# Altium schematic sheet v2.0_with_IO_Expander.SchDoc
size A3
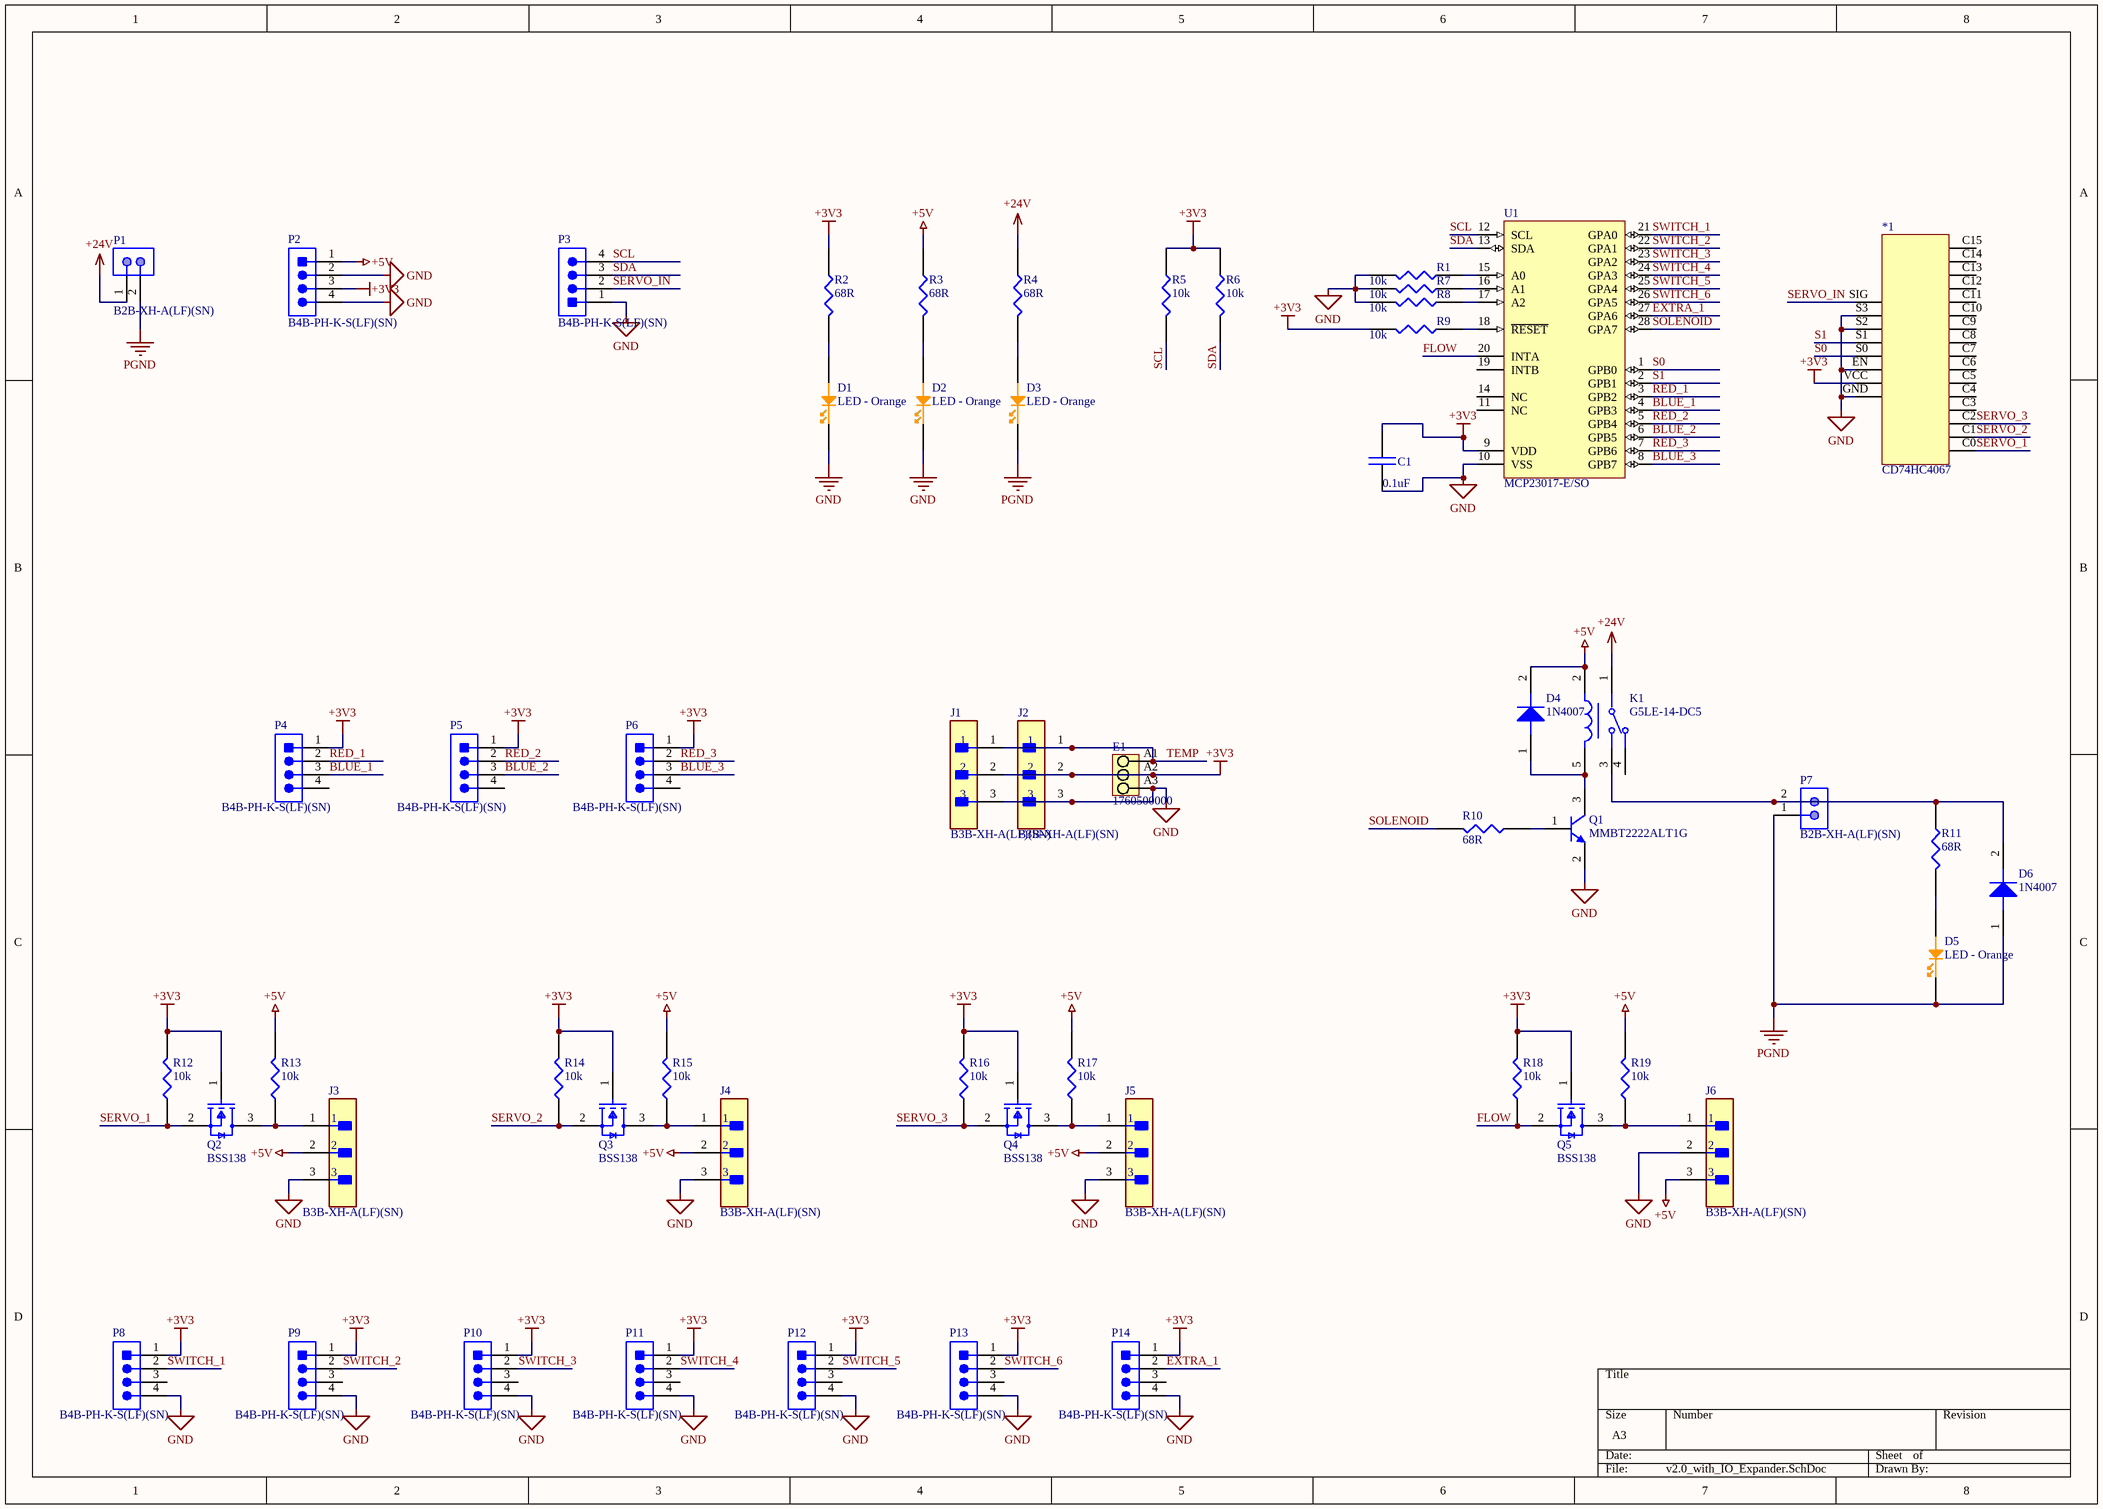
[diagram p0: v2.0_with_IO_Expander.SchDoc]

## Parts
*1  CD74HC4067  [CD74HC4067 Module]
C1  0.1uF  [0.1uF 0603]
D1  LED - Orange  [LED0603-Orange]
D2  LED - Orange  [LED0603-Orange]
D3  LED - Orange  [LED0603-Orange]
D4  1N4007  [M7 1N4007 SMA]
D5  LED - Orange  [LED0603-Orange]
D6  1N4007  [M7 1N4007 SMA]
E1  1760500000  [PM_5_08_90_03]
J1  B3B-XH-A(LF)(SN)  [FP-B3B-XH-A_LF_SN-MFG]
J2  B3B-XH-A(LF)(SN)  [FP-B3B-XH-A_LF_SN-MFG]
J3  B3B-XH-A(LF)(SN)  [FP-B3B-XH-A_LF_SN-MFG]
J4  B3B-XH-A(LF)(SN)  [FP-B3B-XH-A_LF_SN-MFG]
J5  B3B-XH-A(LF)(SN)  [FP-B3B-XH-A_LF_SN-MFG]
J6  B3B-XH-A(LF)(SN)  [FP-B3B-XH-A_LF_SN-MFG]
K1  G5LE-14-DC5  [FP-G5LE-14-DC5-MFG]
P1  B2B-XH-A(LF)(SN)  [JST-B2B-XH-A_V]
P2  B4B-PH-K-S(LF)(SN)  [JST-B4B-PH-K-S_V]
P3  B4B-PH-K-S(LF)(SN)  [JST-B4B-PH-K-S_V]
P4  B4B-PH-K-S(LF)(SN)  [JST-B4B-PH-K-S_V]
P5  B4B-PH-K-S(LF)(SN)  [JST-B4B-PH-K-S_V]
P6  B4B-PH-K-S(LF)(SN)  [JST-B4B-PH-K-S_V]
P7  B2B-XH-A(LF)(SN)  [JST-B2B-XH-A_V]
P8  B4B-PH-K-S(LF)(SN)  [JST-B4B-PH-K-S_V]
P9  B4B-PH-K-S(LF)(SN)  [JST-B4B-PH-K-S_V]
P10  B4B-PH-K-S(LF)(SN)  [JST-B4B-PH-K-S_V]
P11  B4B-PH-K-S(LF)(SN)  [JST-B4B-PH-K-S_V]
P12  B4B-PH-K-S(LF)(SN)  [JST-B4B-PH-K-S_V]
P13  B4B-PH-K-S(LF)(SN)  [JST-B4B-PH-K-S_V]
P14  B4B-PH-K-S(LF)(SN)  [JST-B4B-PH-K-S_V]
Q1  MMBT2222ALT1G  [ONSC-SOT-23-3-318-08_V]
Q2  BSS138  [FP-318-08-IPC_B]
Q3  BSS138  [FP-318-08-IPC_B]
Q4  BSS138  [FP-318-08-IPC_B]
Q5  BSS138  [FP-318-08-IPC_B]
R1  10k  [10k R0603]
R2  68R  [68R 0603]
R3  68R  [68R 0603]
R4  68R  [68R 0603]
R5  10k  [10k R0603]
R6  10k  [10k R0603]
R7  10k  [10k R0603]
R8  10k  [10k R0603]
R9  10k  [10k R0603]
R10  68R  [68R 0603]
R11  68R  [68R 0603]
R12  10k  [10k R0603]
R13  10k  [10k R0603]
R14  10k  [10k R0603]
R15  10k  [10k R0603]
R16  10k  [10k R0603]
R17  10k  [10k R0603]
R18  10k  [10k R0603]
R19  10k  [10k R0603]
U1  MCP23017-E/SO  [SOIC-SO28_N]

## Nets
+3V3: *1.VCC(C17) C1.1 E1.A2 J1.2 J2.2 P2.3 P4.1 P5.1 P6.1 P8.1 P9.1 P10.1 P11.1 P12.1 P13.1 P14.1 Q2.1(G) Q3.1(G) Q4.1(G) Q5.1(G) R2.1 R5.1 R6.1 R9.2 R12.2 R14.2 R16.2 R18.2 U1.9(VDD)
+5V: D4.2(Cathode) J3.2 J4.2 J5.2 J6.3 K1.2 P2.1 R3.1 R13.2 R15.2 R17.2 R19.2
+24V: K1.1 P1.1 R4.1
GND: *1.EN(C18) *1.GND(C16) *1.S2(C21) *1.S3(C22) C1.2 D1.1(Cathode) D2.1(Cathode) E1.A3 J1.3 J2.3 J3.3 J4.3 J5.3 J6.2 P2.2 P2.4 P3.1 P8.4 P9.4 P10.4 P11.4 P12.4 P13.4 P14.4 Q1.2(E) R1.2 R7.2 R8.2 U1.10(VSS)
PGND: D3.1(Cathode) D5.1(Cathode) D6.1(Anode) P1.2 P7.1
BLUE_1: P4.3 U1.4(GPB3)
BLUE_2: P5.3 U1.6(GPB5)
BLUE_3: P6.3 U1.8(GPB7)
EXTRA_1: P14.2 U1.27(GPA6)
FLOW: Q5.2(S) R18.1 U1.20(INTA)
RED_1: P4.2 U1.3(GPB2)
RED_2: P5.2 U1.5(GPB4)
RED_3: P6.2 U1.7(GPB6)
S0: *1.S0(C19) U1.1(GPB0)
S1: *1.S1(C20) U1.2(GPB1)
SCL: P3.4 R5.2 U1.12(SCL)
SDA: P3.3 R6.2 U1.13(SDA)
SERVO_1: *1.C0 Q2.2(S) R12.1
SERVO_2: *1.C1 Q3.2(S) R14.1
SERVO_3: *1.C2 Q4.2(S) R16.1
SERVO_IN: *1.SIG(C23) P3.2
SOLENOID: R10.2 U1.28(GPA7)
SWITCH_1: P8.2 U1.21(GPA0)
SWITCH_2: P9.2 U1.22(GPA1)
SWITCH_3: P10.2 U1.23(GPA2)
SWITCH_4: P11.2 U1.24(GPA3)
SWITCH_5: P12.2 U1.25(GPA4)
SWITCH_6: P13.2 U1.26(GPA5)
TEMP: E1.A1 J1.1 J2.1
NetD1_2: D1.2(Anode) R2.2
NetD2_2: D2.2(Anode) R3.2
NetD3_2: D3.2(Anode) R4.2
NetD4_1: D4.1(Anode) K1.5 Q1.3(C)
NetD5_2: D5.2(Anode) R11.2
NetD6_2: D6.2(Cathode) K1.3 P7.2 R11.1
NetJ3_1: J3.1 Q2.3(D) R13.1
NetJ4_1: J4.1 Q3.3(D) R15.1
NetJ5_1: J5.1 Q4.3(D) R17.1
NetJ6_1: J6.1 Q5.3(D) R19.1
NetQ1_1: Q1.1(B) R10.1
NetR1_1: R1.1 U1.15(A0)
NetR7_1: R7.1 U1.16(A1)
NetR8_1: R8.1 U1.17(A2)
NetR9_1: R9.1 U1.18(~{RESET})

Not connected (* = marked no-connect by the designer): *1 C3(4) C4(5) C5(6) C6(7) C7(8) C8(9) C9(10) C10(11) C11(12) C12(13) C13(14) C14(15) C15(16); K1 4; P4 4; P5 4; P6 4; P8 3; P9 3; P10 3; P11 3; P12 3; P13 3; P14 3; U1 11(NC) 14(NC) 19(INTB)

## Library data of the parts
C1 = C0603C104M4RACTU: CAP CER 0.1UF 16V X7R 0603; Manufacturer: KEMET; Dielectric Material: Ceramic; Capacitance: 100nF; Tolerance: 20%; Supplier 1: Digi-Key; Supplier Part Number 1: 399-1099-1-ND; Manufacturer Part Number: C0603C104M4RACTU; RoHS: Yes; Category: Ceramic Capacitors; Stock 1: 114153; Pricing 1: 1=0.10000, 10=0.03100, 50=0.01720, 100=0.01400, 500=0.01002, 1000=0.00787 (USD); Mount: Surface Mount,PCB; Case/Package: 0603; Number of Pins: 2; Case Code (Metric): 1608; Case Code (Imperial): 0603; Min Operating Temperature: -55°C; Max Operating Temperature: 125°C; Package Quantity: 1; Voltage Rating: 16V; Packaging: Tape and Reel; Voltage Rating (DC): 16V; Dielectric: X7R; Termination: SMD/SMT; Length: 1.6mm; Height: 0.8mm; Width: 0.031inch; Thickness: 0.034inch; Lead Pitch: 0.7mm; Depth: 0.8mm; Radiation Hardening: No; REACH SVHC: No SVHC; ComponentLink1URL: https://datasheet.ciiva.com/18102/getdatasheetpartid-66190-18102310.pdf?src-supplier=Verical; ComponentLink1Description: https://datasheet.ciiva.com/18102/getdatasheetpartid-66190-18102310.pdf?src-supplier=Verical; ComponentLink2URL: https://datasheet.ciiva.com/7823/kem-c1002-x7r-smd-7823992.pdf?src-supplier=Element14; ComponentLink2Description: https://datasheet.ciiva.com/7823/kem-c1002-x7r-smd-7823992.pdf?src-supplier=Element14; ComponentLink3URL: https://datasheet.ciiva.com/7823/kem-c1002-x7r-smd-7823993.pdf?src-supplier=Element14; ComponentLink3Description: https://datasheet.ciiva.com/7823/kem-c1002-x7r-smd-7823993.pdf?src-supplier=Element14; ComponentLink4URL: https://datasheet.ciiva.com/14589/70095383-14589450.pdf?src-supplier=Allied+Electronics; ComponentLink4Description: https://datasheet.ciiva.com/14589/70095383-14589450.pdf?src-supplier=Allied+Electronics; ComponentLink5URL: https://datasheet.ciiva.com/18192/getdatasheetpartid-302288-18192716.pdf?src-supplier=Verical; ComponentLink5Description: https://datasheet.ciiva.com/18192/getdatasheetpartid-302288-18192716.pdf?src-supplier=Verical
D1-D3 D5 = LTST-C191KFKT: LED ORANGE CLEAR SMD; Manufacturer: Vishay Lite-On; Lens Color: Colorless; Wavelength: 611nm; Number of LEDs: 1; Viewing Angle: 130°; Lens Style: Diffused,Colorless,Rectangular; Luminous Intensity: 90mcd; Forward Current: 30mA; Forward Voltage: 2V; Power Rating: 75mW; Reverse Voltage: 5V; Dominant Wavelength: 605nm; Test Current: 20mA; Supplier 1: Digi-Key; Supplier Part Number 1: 160-1445-1-ND; Manufacturer Part Number: LTST-C191KFKT; RoHS: Yes; Category: LEDs; Stock 1: 92562; Pricing 1: 1=0.24000, 10=0.17900, 100=0.08460, 500=0.05640, 1000=0.04418, 2500=0.04324 (USD); Mount: Surface Mount; Case/Package: 0603; Number of Pins: 2; Case Code (Metric): 1608; Color: Orange; Case Code (Imperial): 0603; Min Operating Temperature: -55°C; Max Operating Temperature: 85°C; Package Quantity: 1; Packaging: Tape and Reel; Illumination Color: Orange; Lens Transparency: Clear; Number of Elements: 1; Power Dissipation: 75mW; Length: 1.6mm; Height: 0.55mm; Width: 0.8mm; Depth: 0.8mm; Radiation Hardening: No; Lead Free: Lead Free; ComponentLink1URL: https://datasheet.ciiva.com/2109/ltst-c191kfkt-2109968.pdf?src-supplier=Digi-Key; ComponentLink1Description: https://datasheet.ciiva.com/2109/ltst-c191kfkt-2109968.pdf?src-supplier=Digi-Key; ComponentLink2URL: https://datasheet.ciiva.com/12400/100-ltst-c191kfkt-39904-12400811.pdf?src-supplier=Mouser; ComponentLink2Description: https://datasheet.ciiva.com/12400/100-ltst-c191kfkt-39904-12400811.pdf?src-supplier=Mouser; ComponentLink3URL: https://datasheet.ciiva.com/11775/0900766b80dc02b0-11775613.pdf?src-supplier=RSComponents; ComponentLink3Description: https://datasheet.ciiva.com/11775/0900766b80dc02b0-11775613.pdf?src-supplier=RSComponents; ComponentLink4URL: https://datasheet.ciiva.com/15201/getdatasheetpartid-631075-15201391.pdf?src-supplier=Verical; ComponentLink4Description: https://datasheet.ciiva.com/15201/getdatasheetpartid-631075-15201391.pdf?src-supplier=Verical; ComponentLink5URL: https://datasheet.ciiva.com/2109/s-110-ltst-c191kfkt-2109969.pdf?src-supplier=Digi-Key; ComponentLink5Description: https://datasheet.ciiva.com/2109/s-110-ltst-c191kfkt-2109969.pdf?src-supplier=Digi-Key
D4 D6 = 1N4007FLTR: 1000V 1A Rectifier; Manufacturer: Sangdest Microelectronics; Supplier 1: Digi-Key; Supplier Part Number 1: 1655-1N4007FLCT-ND; Manufacturer Part Number: 1N4007FLTR; RoHS: No; Stock 1: 2517; Pricing 1: 1=0.10000, 10=0.06600, 100=0.03120, 500=0.01848, 1000=0.01241 (USD)
E1 = CMP-1559-01629-1: OMNIMATE Signal - series PM; Manufacturer: Weidmueller; Pitch_mm: 5,08 mm; Pitch_inch: 0,2 inch; Wire_cross_section_AWG_min_UL_1059: AWG 26; Contact_surface: tinned; Contact_material: Cu-Leg; Short_text_for_material: PM 5.08/03/90 3.5SN OR BX; Rated_voltage_use_group_B_UL_1059: 300 V; Solid_min_H05_07_V_U: 0,13 mm²; Solder_pin_length_mm: 3,5 mm; Rated_voltage_for_surge_voltage_class_pollution_degree_II_2: 600 V; Mounting_onto_the_PCB: Solder connection; Solid_max_H05_07_V_U: 2,5 mm²; Side_termination_characteristic: closed side; Rated_current_use_group_B_UL_1059: 15 A; Wire_cross_section_AWG_max_UL_1059: AWG 14; Insulating_material: Wemid (PA); UL_94_flammability_rating: V-0; No_of_poles: 3; ComponentLink2Description: URL Link1; ComponentLink1Description: Manufacturer URL; PartNumber: 1760500000; ComponentLink2URL: http://catalog.weidmueller.com/catalog/Start.do?localeId=en&ObjectID=1760500000; ComponentLink1URL: http://www.weidmueller.com/; Qty: 500 PCS; Colour: Orange; Packaging: Box; Revision: V1; PackageReference: PM_5_08_90_03
J1-J6 = CMP-17439-000014-1: CONN HEADER VERT 3POS 2.5MM; Manufacturer: JST; Conn Gender: Male; Conn Orientation: Vertical; Voltage Rating: 250V; Number Of Contacts: 3; Current Rating: 3A; Contact Material: Tin,Copper; Temperature Range Low: -25°C; Octopart: https://octopart.com/b3b-xh-a%28lf%29%28sn%29-jst-3990185; Device Class L3: unset; Device Class L1: Connectors; Lead Free: Yes; Temperature: -25°C to +85°C; Manufacturer Part Number: B3B-XH-A(LF)(SN); Package: 0; ComponentLink2Description: Datasheet; Pitch: 2.5mm; RoHS: TRUE; Category: Conn; Automotive: No; Temperature Range High: +85°C; Height: 7mm; Device Class L2: Headers and Wire Housings; Number Of Rows: 1; Digikey Description: CONN HEADER VERT 3POS 2.5MM; ComponentLink2URL: https://www.jst-mfg.com/product/pdf/eng/eXH.pdf
K1 = CMP-08822-000008-1: RELAY GEN PURPOSE SPDT 10A 5V; Manufacturer: Omron; Number Of Contacts: 1; Coil Type: Non-Latching; Coil Current: 79.4mA; Coil Power: 400mW; Coil Resistance: 63Ω; Standoff Height: 0.5mm; Throw Configuration: SPDT; Ambient Temperature Range Low: -25°C; Package: 0; Device Class L2: Relays; Temperature Range High: +85°C; ComponentLink2Description: Datasheet; Octopart: https://octopart.com/g5le-14-dc5-omron-28829; Coil Voltage: 5V; Lead Free: Yes; Digikey Description: RELAY GEN PURPOSE SPDT 10A 5V; Device Class L1: Electromechanical; Device Class L3: Power Relays; ComponentLink2URL: https://omronfs.omron.com/en_US/ecb/products/pdf/en-g5le.pdf; Temperature: -25°C to +85°C; Ambient Temperature Range High: +85°C; RoHS: TRUE; Automotive: No; Height: 19mm; Category: Relay; Manufacturer Part Number: G5LE-14-DC5; Mouser Description: General Purpose Relays Power PCB Relay SPDT Sealed 5VDC; Current Rating: 10A; Switching Current: 10A; Temperature Range Low: -25°C
P1 P7 = CMP-2000-05888-1: Male Header, Pitch 2.5 mm, 1 x 2 Position, Height 7 mm, Tail Length 3.4 mm, -25 to 85 degC, RoHS, Bulk; Manufacturer: JST; No of Positions: 2; Pitch: 2.5mm; Style/Orientation: StraightHeader/Plug; Datasheet Version: 05/2016; Package Description: Male Header, Pitch 2.5 mm, 1 x 2 Position, Height 7 mm, Tail Length 3.4 mm; Package Reference: B2B-XH-A; Mounting Technology: ThroughHole; Type: ShroudedHeader; Datasheet URL: http://www.jst-mfg.com/product/pdf/eng/eXH.pdf; Manufacturer URL: http://www.jst.com/home2.html; Termination: Crimp
P2-P6 P8-P14 = CMP-2000-05165-1: Male Header, Pitch 2 mm, 1 x 4 Position, Height 6 mm, Tail Length 3.4 mm, -25 to 85 degC, RoHS, Bulk; Manufacturer: JST; No of Positions: 4; Style/Orientation: StraightHeader/Plug; Pitch: 2mm; Datasheet URL: http://datasheet.octopart.com/B4B-PH-K-S%28LF%29%28SN%29-JST-datasheet-10558886.pdf; Type: ShroudedHeader; Manufacturer URL: http://www.jst.com/home2.html; Termination: Crimp; Datasheet Version: Apr-09
Q1 = CMP-1048-00538-1: General Purpose Transistor, NPN Silicon, 3-Pin SOT-23, Pb-Free, Tape and Reel; Manufacturer: On Semiconductor; fT Min (MHz): 300; IC Continuous (A): 0.6; ComponentLink3URL: http://www.onsemi.cn/pub_link/Collateral/318-08.PDF; PartNumber: MMBT2222ALT1G; RoHS: TRUE; ComponentLink1URL: http://www.onsemi.com/; ComponentLink3Description: Package Specification; ComponentLink2Description: Datasheet; Mounting Technology: Surface Mount; Packing: Tape and Reel; PackageDescription: 3-Pin Small Outline Transistor, Body 2.92 x 1.3 mm, Pitch 0.95 mm; DatasheetVersion: Rev. 10; PackageReference: SOT-23-3-318-08; ComponentLink2URL: http://www.onsemi.cn/pub_link/Collateral/MMBT2222LT1-D.PDF; Polarity: NPN; PackageVersion: Rev. AP, 11/2009; ComponentLink1Description: Manufacturer URL
Q2-Q5 = CMP-07173-000101-1: MOSFET N-CH 50V 220MA SOT-23; Turn-Off Delay Time: 20ns; Element Configuration: Single; Rds On Max: 3.5R; Gate to Source Voltage (Vgs): 20V; Threshold Voltage: 1.3V; Number of Elements: 1; Power Dissipation: 360mW; Rise Time: 9ns; Turn-On Delay Time: 2.5ns; Input Capacitance: 27pF; On-State Resistance: 6R; Lead Free: Lead Free; Length: 2.92mm; Width: 1.3mm; Drain to Source Breakdown Voltage: 50V; Min Operating Temperature: -55°C; REACH SVHC: No SVHC; Packaging: Tape and Reel; Radiation Hardening: No; Height: 0.93mm; Drain to Source Voltage (Vdss): 50V; Current Rating: 220mA; Voltage Rating (DC): 50V; Weight: 0.03g; Continuous Drain Current (ID): 220mA; Number of Pins: 3; Nominal Vgs: 1.3V; Max Power Dissipation: 360mW; Fall Time: 9ns; Drain to Source Resistance: 3.5R; Contact Plating: Tin; Case/Package: SOT-23; Package Quantity: 1; Dual Supply Voltage: 50V; Mount: Surface Mount; Termination: SMD/SMT; Max Operating Temperature: 150°C
R1 R5-R9 R12-R19 = CRG0603F10K/10: RES 10.0K OHM 1/10W 1% 0603; Manufacturer: TE Connectivity; Voltage Rating: 50V; Number of Resistors: 1; Resistance: 10kR; Power Rating: 100mW; Temperature Coefficient: 100ppm/°C; Supplier 1: Digi-Key; Supplier Part Number 1: A121523CT-ND; Manufacturer Part Number: CRG0603F10K/10; RoHS: Yes; Category: Chip SMD Resistors; Stock 1: 172089; Pricing 1: 1=0.10000, 10=0.03100, 100=0.01270, 1000=0.00570, 2500=0.00494, 5000=0.00409 (USD); Mount: Surface Mount; Case/Package: 0603; Weight: 7.1E-05oz; Case Code (Imperial): 0603; Min Operating Temperature: -55°C; Max Operating Temperature: 125°C; Resistor Type: Thick Film; Number of Terminations: 2; Termination: Solder; Packaging: Tape and Reel; Tolerance: 1%; Package Quantity: 10000; Max Power Dissipation: 100mW; Length: 1.6mm; Height: 0.022inch; Depth: 0.8mm; Width: 0.8mm; Radiation Hardening: No; Military Standard: Not; ELV: Compliant; ComponentLink1URL: https://datasheet.ciiva.com/2530/eng-cd-1622829-ba-2530062.pdf?src-supplier=Digi-Key; ComponentLink1Description: https://datasheet.ciiva.com/2530/eng-cd-1622829-ba-2530062.pdf?src-supplier=Digi-Key
R2-R4 R10 R11 = CRGP0603F68R: CRGP 0603 68R 1%; Manufacturer: TE Connectivity; Max Power Dissipation: 250mW; Temperature Coefficient: 200ppm/°C; Supplier 1: Digi-Key; Supplier Part Number 1: A130402CT-ND; Manufacturer Part Number: CRGP0603F68R; RoHS: No; Category: Chip SMD Resistors; Stock 1: 49308; Pricing 1: 1=0.14000, 10=0.11400, 100=0.04470, 1000=0.01870, 2500=0.01714 (USD); Case/Package: 0603; Case Code (Imperial): 0603; Case Code (Metric): 1608; Min Operating Temperature: -55°C; Max Operating Temperature: 155°C; Resistor Type: Thick Film; Packaging: Tape and Reel; Resistance: 68R; Tolerance: 1%; Number of Terminations: 2; ComponentLink1URL: https://www.te.com/commerce/DocumentDelivery/DDEController?Action=srchrtrv&amp;DocNm=9-1773463-9&amp;DocType=DS&amp;DocLang=English&src-supplier=Digi-Key; ComponentLink1Description: https://www.te.com/commerce/DocumentDelivery/DDEController?Action=srchrtrv&amp;DocNm=9-1773463-9&amp;DocType=DS&amp;DocLang=English&src-supplier=Digi-Key
U1 = CMP-0186-00161-2: 16-Bit I/O Expander with Serial Interface, 28-Pin SOIC, Extended Temperature; PackageReference: SOIC-SO28; ComponentLink2URL: http://ww1.microchip.com/downloads/en/DeviceDoc/21952b.pdf; PackageVersion: revBB, Aug-2009; ComponentLink1URL: http://www.microchip.com/; Code_JEDEC: MS-013; ComponentLink2Description: Datasheet; DatasheetVersion: revB, Feb-2007; PackageDescription: 28-Lead Plastic Small Outline (SO) - Wide 7.50mm Body [SOIC]; ComponentLink3Description: Package Specification; ComponentLink1Description: Manufacturer URL; RevisionNote: URLs added.; ComponentLink3URL: http://www.microchip.com/stellent/groups/techpub_sg/documents/packagingspec/en012702.pdf